# EAGLE design V0_1 (EAGLE 9.6.2)
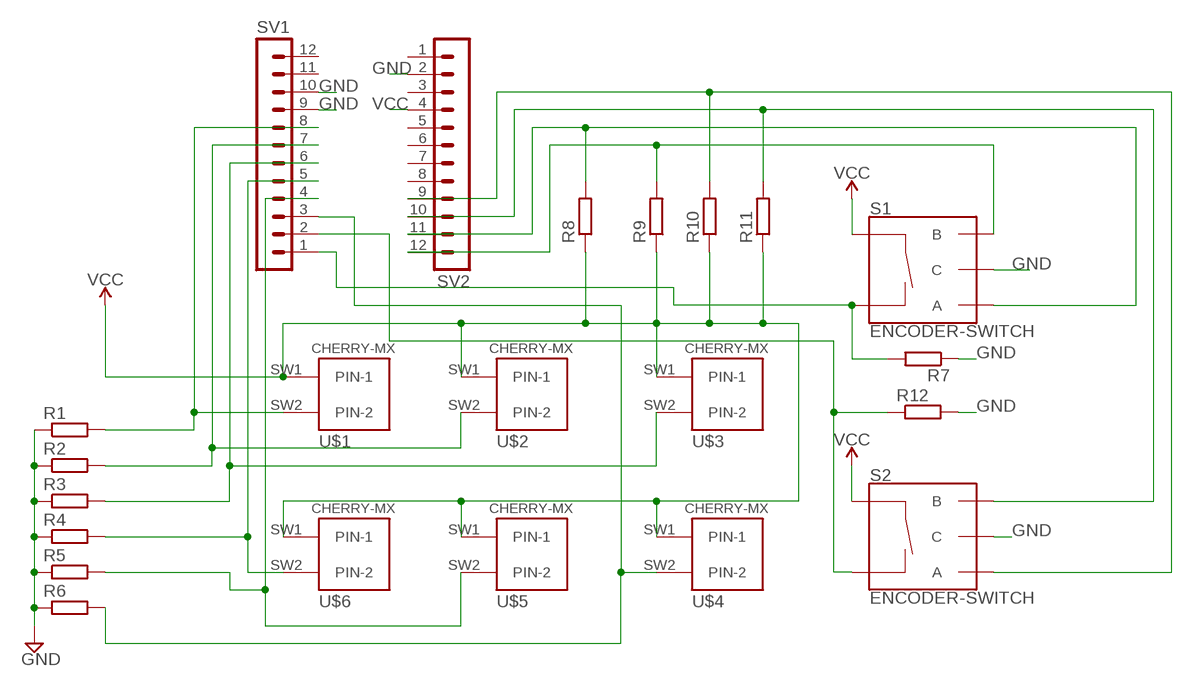
[diagram p0: schematic, sheet 1]

## Parts
R1  R-EU_0207/10  [0207/10]
R2  R-EU_0207/10  [0207/10]
R3  R-EU_0207/10  [0207/10]
R4  R-EU_0207/10  [0207/10]
R5  R-EU_0207/10  [0207/10]
R6  R-EU_0207/10  [0207/10]
R7  R-EU_0207/10  [0207/10]
R8  R-EU_0207/10  [0207/10]
R9  R-EU_0207/10  [0207/10]
R10  R-EU_0207/10  [0207/10]
R11  R-EU_0207/10  [0207/10]
R12  R-EU_0207/10  [0207/10]
S1  ENCODER-SWITCH  [ROTARY_ENC_PLAIN]
S2  ENCODER-SWITCH  [ROTARY_ENC_PLAIN]
SV1  MA12-1  [MA12-1]
SV2  MA12-1  [MA12-1]
U$1  CHERRY-MX  [CHERRY-MX]
U$2  CHERRY-MX  [CHERRY-MX]
U$3  CHERRY-MX  [CHERRY-MX]
U$4  CHERRY-MX  [CHERRY-MX]
U$5  CHERRY-MX  [CHERRY-MX]
U$6  CHERRY-MX  [CHERRY-MX]

## Nets
GND: R1.1 R2.1 R3.1 R4.1 R5.1 R6.1 R7.1 R12.2 S1.C S2.C SV1.9 SV1.10 SV2.2
N$1: R1.2 SV1.8 U$1.SW2(PIN-2)
N$2: R2.2 SV1.7 U$2.SW2(PIN-2)
N$3: R3.2 SV1.6 U$3.SW2(PIN-2)
N$4: R4.2 SV1.5 U$6.SW2(PIN-2)
N$5: R5.2 SV1.4 U$5.SW2(PIN-2)
N$6: R6.2 SV1.3 U$4.SW2(PIN-2)
N$7: R9.2 S1.B SV2.12
N$8: R8.2 S1.A SV2.11
N$9: R7.2 S1.SW- SV1.1
N$10: R11.2 S2.B SV2.10
N$11: R10.2 S2.A SV2.9
N$12: R12.1 S2.SW- SV1.2
VCC: R8.1 R9.1 R10.1 R11.1 S1.SW+ S2.SW+ SV2.4 U$1.SW1(PIN-1) U$2.SW1(PIN-1) U$3.SW1(PIN-1) U$4.SW1(PIN-1) U$5.SW1(PIN-1) U$6.SW1(PIN-1)
Unconnected: SV1.11 SV1.12 SV2.1 SV2.3 SV2.5 SV2.6 SV2.7 SV2.8

## Library data of the parts
R1-R12 = rcl:R-EU_: RESISTOR, European symbol; SPICEPREFIX: R
S1 S2 = SparkFun-Switches:ENCODER-SWITCH: Rotary Encoder w/ Select Switch Encoders rotate similarly to potentiometers, but they’re different from potentiometers in that an encoder has full rotation without limits. They output gray code so that you can tell how much and in which direction the encoder has been turned. This encoder includes a push-down select switch built into the shaft. SparkFun Products Rotary Encoder <https://www.sparkfun.com/products/9117> (COM-09117); SF_SKU: COM-09117
SV1 SV2 = con-lstb:MA12-1: PIN HEADER; OC_FARNELL: unknown; OC_NEWARK: unknown
U$1-U$6 = cherrymx:CHERRY-MX: Cherry MX series keyswitch

## Board
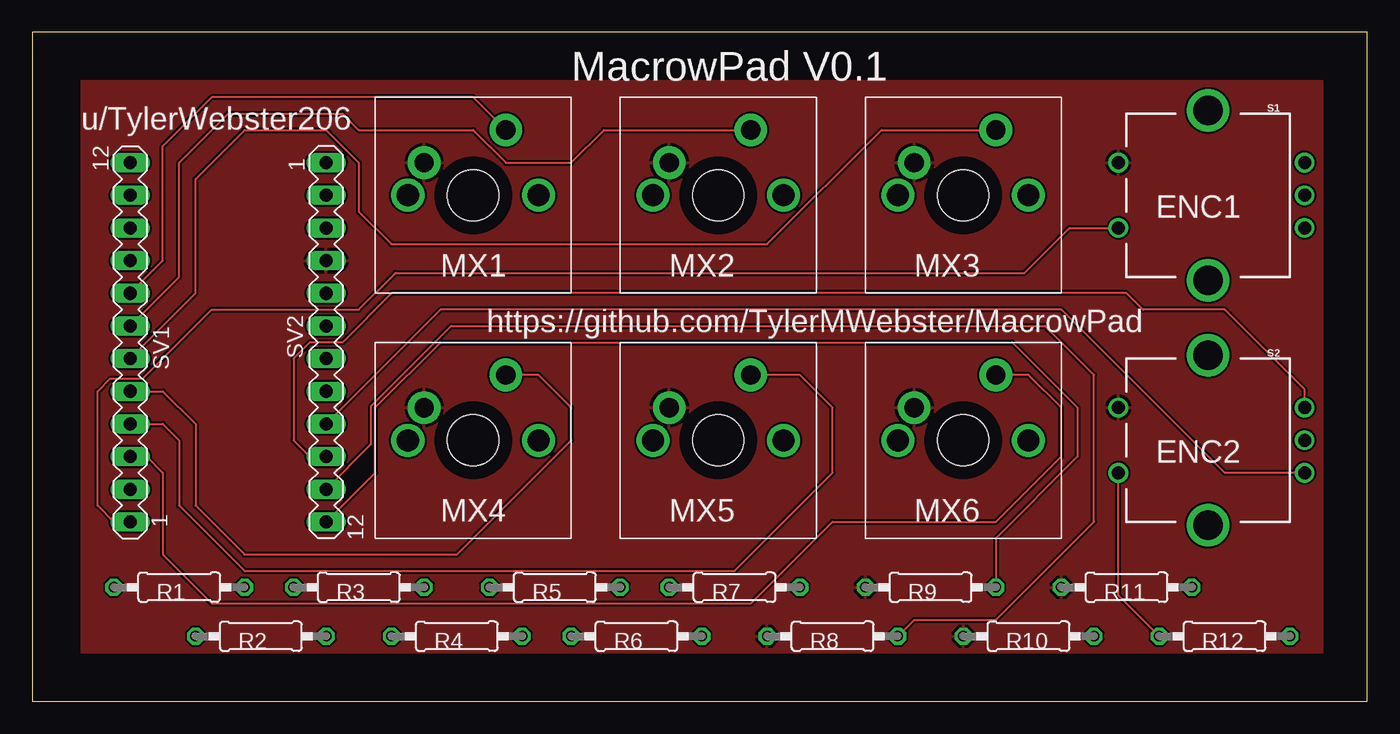
[diagram p1: board, top side]
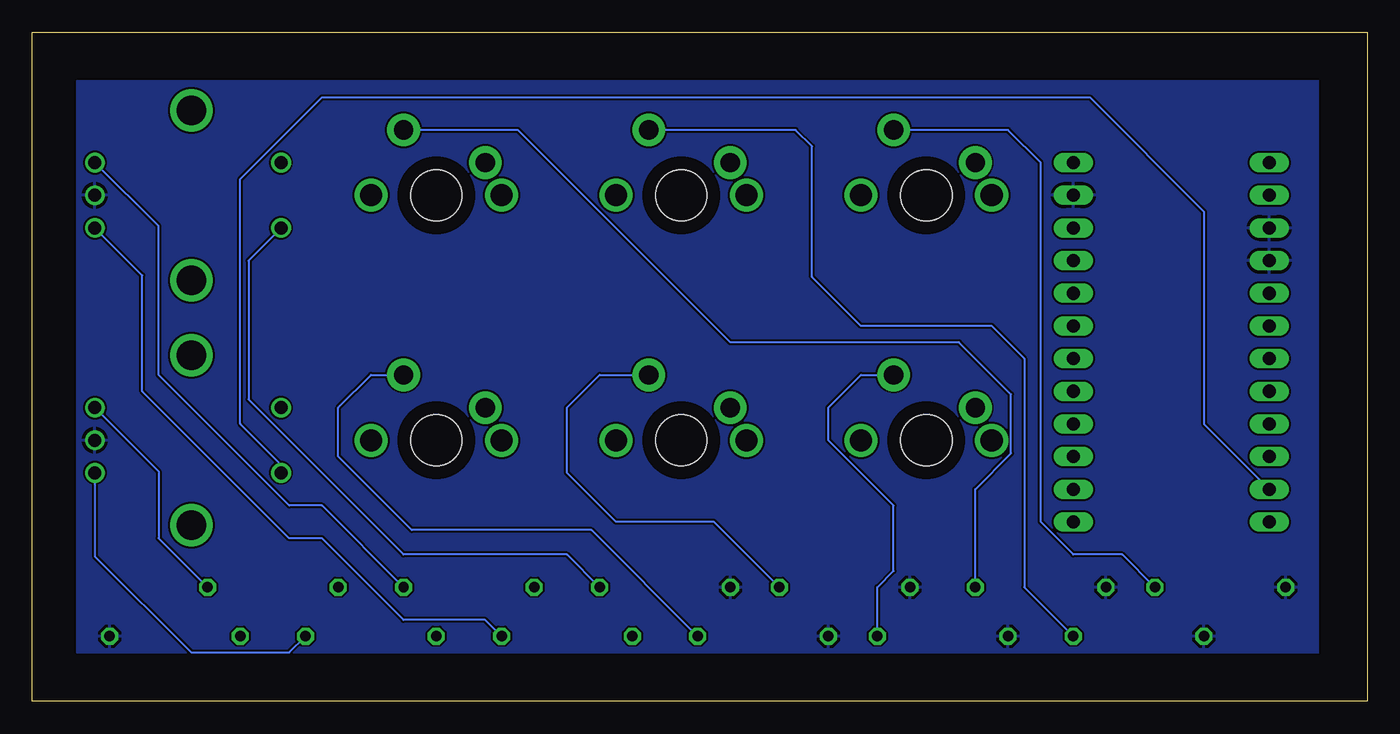
[diagram p2: board, bottom side, seen from below]

Size 103.81 x 52.06 mm. Coordinates in mm from the lower left corner, seen from the top.
Outline: 0,0 103.81,0 103.81,52.06 0,52.06 0,0
Copper layers (1*16): Top 0.035mm / dielectric 1.5mm / Bottom 0.035mm
Design rules "default": minimum track width 6mil, minimum drill 0.35mm, track to track 6mil, track to pad 6mil, pad to pad 6mil, via to via 6mil, smd to smd 6mil, copper to edge 40mil, drill to drill 6mil, minimum pad ring 10mil, minimum via ring 8mil, stop-mask expansion 4mil, vias tented up to drill 0mil, thermal gap 10mil

### Footprints (pad centres in the part's own frame; a part is rotated, then mirrored left to right if it is on the bottom)
0207/10 = drill 0.813 octagon: 1 -5.08,0; 2 5.08,0
ROTARY_ENC_PLAIN = drill 1.016: A 7.493,-2.54; B 7.493,2.54; C 7.493,0; SW+ -6.985,2.54; SW- -6.985,-2.54 | drill 2.286: P$3 0,6.604; P$4 0,-6.604
MA12-1 = drill 1.016 long: 1 -13.97,0; 2 -11.43,0; 3 -8.89,0; 4 -6.35,0; 5 -3.81,0; 6 -1.27,0; 7 1.27,0; 8 3.81,0; 9 6.35,0; 10 8.89,0; 11 11.43,0; 12 13.97,0
CHERRY-MX = drill 1.714 pad 1.93: P$3 -5.08,0; P$4 5.08,0 | drill 1.5 pad 2.54: SW1 -3.81,2.54; SW2 2.54,5.08 | hole 4: 0,0

### Placement (x,y rotation side)
R1  11.43,8.89 0 top
R2  17.78,5.08 0 top
R3  25.4,8.89 0 top
R4  33.02,5.08 0 top
R5  40.64,8.89 0 top
R6  46.99,5.08 0 top
R7  54.61,8.89 0 top
R8  62.23,5.08 0 top
R9  69.85,8.89 0 top
R10  77.47,5.08 0 top
R11  85.09,8.89 0 top
R12  92.71,5.08 0 top
S1  91.44,39.37 0 top
S2  91.44,20.32 0 top
SV1  7.62,27.94 90 top
SV2  22.86,27.94 270 top
U$1  34.29,39.37 0 top
U$2  53.34,39.37 0 top
U$3  72.39,39.37 0 top
U$4  72.39,20.32 0 top
U$5  53.34,20.32 0 top
U$6  34.29,20.32 0 top

### Tracks (layer width: path | path; a pad name or v marks a point on that pad's centre or on a via)
GND
  pour Bottom: 3.81,48.26 100.33,48.26 100.33,3.81 3.81,3.81
N$1
  Top 0.152: SV1.8 10.16,34.29 10.16,43.18 13.97,46.99 34.29,46.99 U$1.SW2
  Bottom 0.152: R1.2 19.05,11.43 22.86,11.43 25.4,13.97 25.4,41.91 27.94,44.45 U$1.SW2
N$2
  Top 0.152: SV1.7 11.43,33.02 11.43,41.91 15.24,45.72 24.13,45.72 25.4,44.45 34.29,44.45 36.83,41.91 41.91,41.91 44.45,44.45 U$2.SW2
  Bottom 0.152: R2.2 26.67,8.89 26.67,26.67 29.21,29.21 39.37,29.21 43.18,33.02 43.18,43.18 44.45,44.45 U$2.SW2
N$3
  Top 0.152: SV1.6 12.7,31.75 12.7,40.64 16.51,44.45 22.86,44.45 25.4,41.91 25.4,38.1 27.94,35.56 57.15,35.56 66.04,44.45 U$3.SW2
  Bottom 0.152: U$3.SW2 66.04,44.45 49.53,27.94 31.75,27.94 27.7,23.89 27.7,19.29 30.48,16.51 R3.2
N$4
  Top 0.152: SV1.5 10.16,24.13 12.7,21.59 12.7,15.24 16.51,11.43 33.02,11.43 41.91,20.32 41.91,22.86 39.37,25.4 U$6.SW2
  Bottom 0.152: R4.2 38.1,8.89 36.83,10.16 36.83,15.24 41.91,20.32 41.91,22.86 39.37,25.4 U$6.SW2
N$5
  Top 0.152: SV1.4 10.16,21.59 11.43,20.32 11.43,15.24 16.51,10.16 54.61,10.16 62.23,17.78 62.23,22.86 59.69,25.4 U$5.SW2
  Bottom 0.152: U$5.SW2 59.69,25.4 62.23,22.86 62.23,17.78 58.42,13.97 50.8,13.97 R5.2
N$6
  Top 0.152: SV1.3 8.89,19.05 10.16,17.78 10.16,11.43 13.97,7.62 55.88,7.62 62.23,13.97 74.93,13.97 80.01,19.05 80.01,22.86 77.47,25.4 U$4.SW2
  Bottom 0.152: R6.2 60.32,13.33 74.3,13.33 80.01,19.05 80.01,22.86 77.47,25.4 U$4.SW2
N$7
  Top 0.152: R9.2 74.93,12.7 81.28,19.05 81.28,22.86 76.2,27.94 31.75,27.94 26.67,22.86 26.67,17.78 SV2.12
  Bottom 0.152: R9.2 81.28,15.24 83.82,15.24 93.98,25.4 93.98,36.96 S1.B
N$8
  Top 0.152: R8.2 68.58,6.35 74.93,6.35 82.55,13.97 82.55,25.4 78.74,29.21 32.59,29.21 26.36,22.99 26.36,20.01 SV2.11
  Bottom 0.152: R8.2 68.58,6.35 74.93,6.35 81.28,12.7 83.82,12.7 95.25,24.13 95.25,33.15 S1.A
N$9
  Top 0.152: S1.SW- 80.65,36.83 77.15,33.34 28.26,33.34 25.4,30.48 13.97,30.48 8.61,25.12 6.07,25.12 5.08,24.13 5.08,15.24 6.35,13.97 SV1.1
  Bottom 0.152: S1.SW- 87,34.29 87,23.5 74.93,11.43 62.23,11.43 R7.2
N$10
  Top 0.152: S2.B 98.93,24.26 92.71,30.48 86.36,30.48 85.09,31.75 27.94,31.75 24.13,27.94 21.59,27.94 20.32,26.67 20.32,20.32 21.59,19.05 SV2.10
  Bottom 0.152: R11.2 93.98,12.7 93.98,17.91 S2.B
N$11
  Top 0.152: SV2.9 31.75,30.48 80.01,30.48 92.71,17.78 S2.A
  Bottom 0.152: S2.A 98.93,11.3 91.44,3.81 83.82,3.81 R10.2
N$12
  Top 0.152: R12.1 84.46,8.25 S2.SW-
  Bottom 0.152: S2.SW- 84.46,18.41 87.63,21.59 87.63,40.64 81.28,46.99 21.59,46.99 12.7,38.1 12.7,21.59 SV1.2
VCC
  pour Top: 3.81,48.26 3.81,3.81 100.33,3.81 100.33,48.26

### Text on the board
_tsilk: MacrowPad V0.1 | u/TylerWebster206 | ENC1 | MX1 | MX2 | MX3 | https://github.com/TylerMWebster/MacrowPad | ENC2 | MX4 | MX5 | MX6